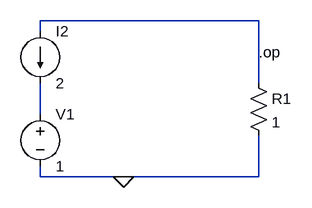
[diagram p0: schematic SeriesVSourceCSource_R.asc]
SeriesVSourceCSource_R.asc, the LTspice schematic file:
Version 4
SHEET 1 880 680
WIRE 528 192 192 192
WIRE 192 208 192 192
WIRE 528 288 528 192
WIRE 192 336 192 288
WIRE 192 432 192 416
WIRE 320 432 192 432
WIRE 528 432 528 368
WIRE 528 432 320 432
FLAG 320 432 0
SYMBOL res 512 272 R0
SYMATTR InstName R1
SYMATTR Value 1
SYMBOL current 192 208 R0
SYMATTR InstName I2
SYMATTR Value 2
SYMBOL voltage 192 320 R0
SYMATTR InstName V1
SYMATTR Value 1
TEXT 528 240 Left 2 !.op

The netlist it stands for:
* SeriesVSourceCSource_R.asc
R1 N001 0 1
I2 N001 N002 2
V1 N002 0 1
.op
.backanno
.end